# Altium schematic sheet FPGA_2.SchDoc: FMC DAC 1.5GS 4CH
size 420 x 297 mm; Author: G.Kasprowicz; CompanyName: WUT ISE; DrawnBy: G.Kasprowicz; Organization: WUT ISE; Address1: PW ISE; Address2: Nowowiejska 15/19 00-665 Warsaw; Address3: gkasprow@gmail.com; Revision: 1; SheetNumber: 22; SheetTotal: 25; ModifiedBy: -; CheckedDate: -; Title2: FMC; DivGrp: WUT ISE; Designer: G.Kasprowicz; ModifiedDate: -; ProjectName: Sensor Box
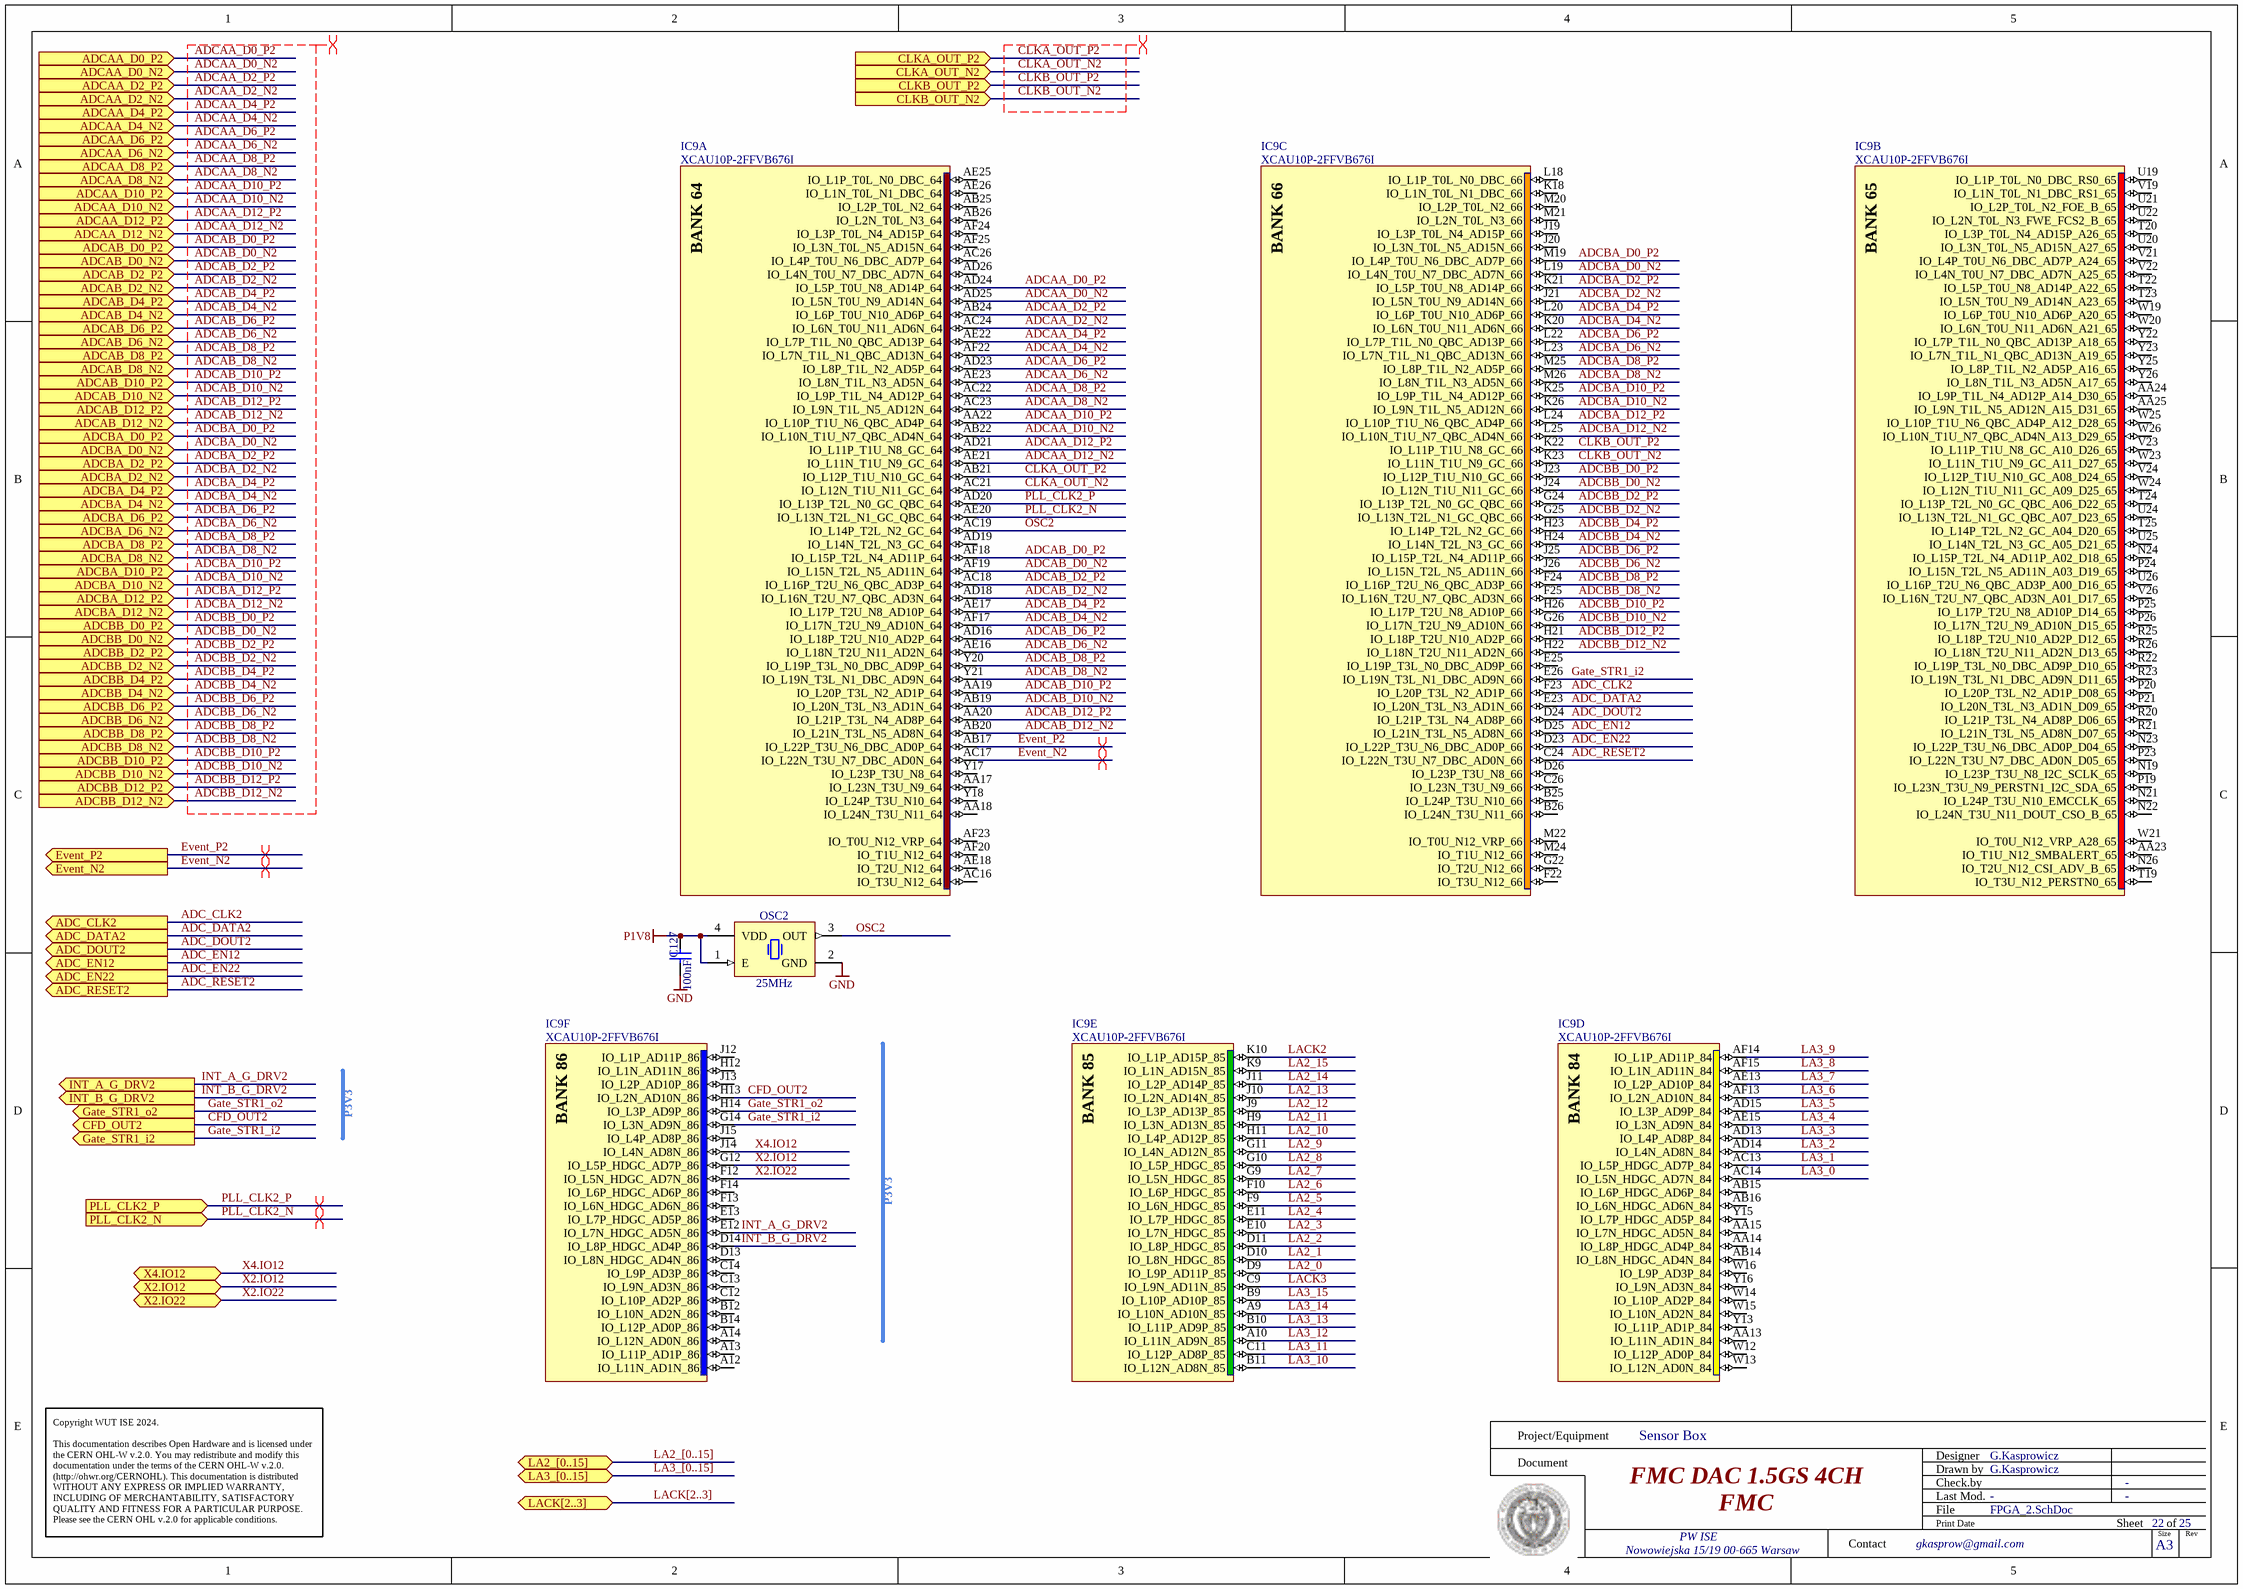
[diagram p0: FPGA_2.SchDoc]

## Parts
C127  100nF  [CAPC1005X55N]
IC9  XCAU10P-2FFVB676I  [BGA676C100P26X26_2700X2700X350]  (parts A,B,C,D,E,F of 13)
OSC2  25MHz  [OSC_ECS_ECS-3518]

## Ports
ADC_CLK2 (out), ADC_DATA2 (out), ADC_DOUT2 (out), ADC_EN12 (out), ADC_EN22 (out), ADC_RESET2 (out), ADCAA_D0_N2 (in), ADCAA_D0_P2 (in), ADCAA_D2_N2 (in), ADCAA_D2_P2 (in), ADCAA_D4_N2 (in), ADCAA_D4_P2 (in), ADCAA_D6_N2 (in), ADCAA_D6_P2 (in), ADCAA_D8_N2 (in), ADCAA_D8_P2 (in), ADCAA_D10_N2 (in), ADCAA_D10_P2 (in), ADCAA_D12_N2 (in), ADCAA_D12_P2 (in), ADCAB_D0_N2 (in), ADCAB_D0_P2 (in), ADCAB_D2_N2 (in), ADCAB_D2_P2 (in), ADCAB_D4_N2 (in), ADCAB_D4_P2 (in), ADCAB_D6_N2 (in), ADCAB_D6_P2 (in), ADCAB_D8_N2 (in), ADCAB_D8_P2 (in), ADCAB_D10_N2 (in), ADCAB_D10_P2 (in), ADCAB_D12_N2 (in), ADCAB_D12_P2 (in), ADCBA_D0_N2 (in), ADCBA_D0_P2 (in), ADCBA_D2_N2 (in), ADCBA_D2_P2 (in), ADCBA_D4_N2 (in), ADCBA_D4_P2 (in), ADCBA_D6_N2 (in), ADCBA_D6_P2 (in), ADCBA_D8_N2 (in), ADCBA_D8_P2 (in), ADCBA_D10_N2 (in), ADCBA_D10_P2 (in), ADCBA_D12_N2 (in), ADCBA_D12_P2 (in), ADCBB_D0_N2 (in), ADCBB_D0_P2 (in), ADCBB_D2_N2 (in), ADCBB_D2_P2 (in), ADCBB_D4_N2 (in), ADCBB_D4_P2 (in), ADCBB_D6_N2 (in), ADCBB_D6_P2 (in), ADCBB_D8_N2 (in), ADCBB_D8_P2 (in), ADCBB_D10_N2 (in), ADCBB_D10_P2 (in), ADCBB_D12_N2 (in), ADCBB_D12_P2 (in), CFD_OUT2 (out), CLKA_OUT_N2 (in), CLKA_OUT_P2 (in), CLKB_OUT_N2 (in), CLKB_OUT_P2 (in), Event_N2 (out), Event_P2 (out), Gate_STR1_i2 (out), Gate_STR1_o2 (out), INT_A_G_DRV2 (out), INT_B_G_DRV2 (out), LA2_[0..15] (bidir), LA3_[0..15] (bidir), LACK[2..3] (bidir), PLL_CLK2_N (in), PLL_CLK2_P (in), X2.IO12 (bidir), X2.IO22 (bidir), X4.IO12 (bidir)

## Nets
GND: C127.1 OSC2.2(GND)
P1V8: C127.2 OSC2.1(E) OSC2.4(VDD)
ADC_CLK2: IC9.F23(IO_L20P_T3L_N2_AD1P_66) ; port ADC_CLK2
ADC_DATA2: IC9.E23(IO_L20N_T3L_N3_AD1N_66) ; port ADC_DATA2
ADC_DOUT2: IC9.D24(IO_L21P_T3L_N4_AD8P_66) ; port ADC_DOUT2
ADC_EN12: IC9.D25(IO_L21N_T3L_N5_AD8N_66) ; port ADC_EN12
ADC_EN22: IC9.D23(IO_L22P_T3U_N6_DBC_AD0P_66) ; port ADC_EN22
ADC_RESET2: IC9.C24(IO_L22N_T3U_N7_DBC_AD0N_66) ; port ADC_RESET2
ADCAA_D0_N2: IC9.AD25(IO_L5N_T0U_N9_AD14N_64) ; port ADCAA_D0_N2
ADCAA_D0_P2: IC9.AD24(IO_L5P_T0U_N8_AD14P_64) ; port ADCAA_D0_P2
ADCAA_D2_N2: IC9.AC24(IO_L6N_T0U_N11_AD6N_64) ; port ADCAA_D2_N2
ADCAA_D2_P2: IC9.AB24(IO_L6P_T0U_N10_AD6P_64) ; port ADCAA_D2_P2
ADCAA_D4_N2: IC9.AF22(IO_L7N_T1L_N1_QBC_AD13N_64) ; port ADCAA_D4_N2
ADCAA_D4_P2: IC9.AE22(IO_L7P_T1L_N0_QBC_AD13P_64) ; port ADCAA_D4_P2
ADCAA_D6_N2: IC9.AE23(IO_L8N_T1L_N3_AD5N_64) ; port ADCAA_D6_N2
ADCAA_D6_P2: IC9.AD23(IO_L8P_T1L_N2_AD5P_64) ; port ADCAA_D6_P2
ADCAA_D8_N2: IC9.AC23(IO_L9N_T1L_N5_AD12N_64) ; port ADCAA_D8_N2
ADCAA_D8_P2: IC9.AC22(IO_L9P_T1L_N4_AD12P_64) ; port ADCAA_D8_P2
ADCAA_D10_N2: IC9.AB22(IO_L10N_T1U_N7_QBC_AD4N_64) ; port ADCAA_D10_N2
ADCAA_D10_P2: IC9.AA22(IO_L10P_T1U_N6_QBC_AD4P_64) ; port ADCAA_D10_P2
ADCAA_D12_N2: IC9.AE21(IO_L11N_T1U_N9_GC_64) ; port ADCAA_D12_N2
ADCAA_D12_P2: IC9.AD21(IO_L11P_T1U_N8_GC_64) ; port ADCAA_D12_P2
ADCAB_D0_N2: IC9.AF19(IO_L15N_T2L_N5_AD11N_64) ; port ADCAB_D0_N2
ADCAB_D0_P2: IC9.AF18(IO_L15P_T2L_N4_AD11P_64) ; port ADCAB_D0_P2
ADCAB_D2_N2: IC9.AD18(IO_L16N_T2U_N7_QBC_AD3N_64) ; port ADCAB_D2_N2
ADCAB_D2_P2: IC9.AC18(IO_L16P_T2U_N6_QBC_AD3P_64) ; port ADCAB_D2_P2
ADCAB_D4_N2: IC9.AF17(IO_L17N_T2U_N9_AD10N_64) ; port ADCAB_D4_N2
ADCAB_D4_P2: IC9.AE17(IO_L17P_T2U_N8_AD10P_64) ; port ADCAB_D4_P2
ADCAB_D6_N2: IC9.AE16(IO_L18N_T2U_N11_AD2N_64) ; port ADCAB_D6_N2
ADCAB_D6_P2: IC9.AD16(IO_L18P_T2U_N10_AD2P_64) ; port ADCAB_D6_P2
ADCAB_D8_N2: IC9.Y21(IO_L19N_T3L_N1_DBC_AD9N_64) ; port ADCAB_D8_N2
ADCAB_D8_P2: IC9.Y20(IO_L19P_T3L_N0_DBC_AD9P_64) ; port ADCAB_D8_P2
ADCAB_D10_N2: IC9.AB19(IO_L20N_T3L_N3_AD1N_64) ; port ADCAB_D10_N2
ADCAB_D10_P2: IC9.AA19(IO_L20P_T3L_N2_AD1P_64) ; port ADCAB_D10_P2
ADCAB_D12_N2: IC9.AB20(IO_L21N_T3L_N5_AD8N_64) ; port ADCAB_D12_N2
ADCAB_D12_P2: IC9.AA20(IO_L21P_T3L_N4_AD8P_64) ; port ADCAB_D12_P2
ADCBA_D0_N2: IC9.L19(IO_L4N_T0U_N7_DBC_AD7N_66) ; port ADCBA_D0_N2
ADCBA_D0_P2: IC9.M19(IO_L4P_T0U_N6_DBC_AD7P_66) ; port ADCBA_D0_P2
ADCBA_D2_N2: IC9.J21(IO_L5N_T0U_N9_AD14N_66) ; port ADCBA_D2_N2
ADCBA_D2_P2: IC9.K21(IO_L5P_T0U_N8_AD14P_66) ; port ADCBA_D2_P2
ADCBA_D4_N2: IC9.K20(IO_L6N_T0U_N11_AD6N_66) ; port ADCBA_D4_N2
ADCBA_D4_P2: IC9.L20(IO_L6P_T0U_N10_AD6P_66) ; port ADCBA_D4_P2
ADCBA_D6_N2: IC9.L23(IO_L7N_T1L_N1_QBC_AD13N_66) ; port ADCBA_D6_N2
ADCBA_D6_P2: IC9.L22(IO_L7P_T1L_N0_QBC_AD13P_66) ; port ADCBA_D6_P2
ADCBA_D8_N2: IC9.M26(IO_L8N_T1L_N3_AD5N_66) ; port ADCBA_D8_N2
ADCBA_D8_P2: IC9.M25(IO_L8P_T1L_N2_AD5P_66) ; port ADCBA_D8_P2
ADCBA_D10_N2: IC9.K26(IO_L9N_T1L_N5_AD12N_66) ; port ADCBA_D10_N2
ADCBA_D10_P2: IC9.K25(IO_L9P_T1L_N4_AD12P_66) ; port ADCBA_D10_P2
ADCBA_D12_N2: IC9.L25(IO_L10N_T1U_N7_QBC_AD4N_66) ; port ADCBA_D12_N2
ADCBA_D12_P2: IC9.L24(IO_L10P_T1U_N6_QBC_AD4P_66) ; port ADCBA_D12_P2
ADCBB_D0_N2: IC9.J24(IO_L12N_T1U_N11_GC_66) ; port ADCBB_D0_N2
ADCBB_D0_P2: IC9.J23(IO_L12P_T1U_N10_GC_66) ; port ADCBB_D0_P2
ADCBB_D2_N2: IC9.G25(IO_L13N_T2L_N1_GC_QBC_66) ; port ADCBB_D2_N2
ADCBB_D2_P2: IC9.G24(IO_L13P_T2L_N0_GC_QBC_66) ; port ADCBB_D2_P2
ADCBB_D4_N2: IC9.H24(IO_L14N_T2L_N3_GC_66) ; port ADCBB_D4_N2
ADCBB_D4_P2: IC9.H23(IO_L14P_T2L_N2_GC_66) ; port ADCBB_D4_P2
ADCBB_D6_N2: IC9.J26(IO_L15N_T2L_N5_AD11N_66) ; port ADCBB_D6_N2
ADCBB_D6_P2: IC9.J25(IO_L15P_T2L_N4_AD11P_66) ; port ADCBB_D6_P2
ADCBB_D8_N2: IC9.F25(IO_L16N_T2U_N7_QBC_AD3N_66) ; port ADCBB_D8_N2
ADCBB_D8_P2: IC9.F24(IO_L16P_T2U_N6_QBC_AD3P_66) ; port ADCBB_D8_P2
ADCBB_D10_N2: IC9.G26(IO_L17N_T2U_N9_AD10N_66) ; port ADCBB_D10_N2
ADCBB_D10_P2: IC9.H26(IO_L17P_T2U_N8_AD10P_66) ; port ADCBB_D10_P2
ADCBB_D12_N2: IC9.H22(IO_L18N_T2U_N11_AD2N_66) ; port ADCBB_D12_N2
ADCBB_D12_P2: IC9.H21(IO_L18P_T2U_N10_AD2P_66) ; port ADCBB_D12_P2
CFD_OUT2: IC9.H13(IO_L2N_AD10N_86) ; port CFD_OUT2
CLKA_OUT_N2: IC9.AC21(IO_L12N_T1U_N11_GC_64) ; port CLKA_OUT_N2
CLKA_OUT_P2: IC9.AB21(IO_L12P_T1U_N10_GC_64) ; port CLKA_OUT_P2
CLKB_OUT_N2: IC9.K23(IO_L11N_T1U_N9_GC_66) ; port CLKB_OUT_N2
CLKB_OUT_P2: IC9.K22(IO_L11P_T1U_N8_GC_66) ; port CLKB_OUT_P2
Event_N2: IC9.AC17(IO_L22N_T3U_N7_DBC_AD0N_64) ; port Event_N2
Event_P2: IC9.AB17(IO_L22P_T3U_N6_DBC_AD0P_64) ; port Event_P2
Gate_STR1_i2: IC9.E26(IO_L19N_T3L_N1_DBC_AD9N_66) IC9.G14(IO_L3N_AD9N_86) ; port Gate_STR1_i2
Gate_STR1_o2: IC9.H14(IO_L3P_AD9P_86) ; port Gate_STR1_o2
INT_A_G_DRV2: IC9.E12(IO_L7N_HDGC_AD5N_86) ; port INT_A_G_DRV2
INT_B_G_DRV2: IC9.D14(IO_L8P_HDGC_AD4P_86) ; port INT_B_G_DRV2
LA2_0: IC9.D9(IO_L9P_AD11P_85)
LA2_1: IC9.D10(IO_L8N_HDGC_85)
LA2_2: IC9.D11(IO_L8P_HDGC_85)
LA2_3: IC9.E10(IO_L7N_HDGC_85)
LA2_4: IC9.E11(IO_L7P_HDGC_85)
LA2_5: IC9.F9(IO_L6N_HDGC_85)
LA2_6: IC9.F10(IO_L6P_HDGC_85)
LA2_7: IC9.G9(IO_L5N_HDGC_85)
LA2_8: IC9.G10(IO_L5P_HDGC_85)
LA2_9: IC9.G11(IO_L4N_AD12N_85)
LA2_10: IC9.H11(IO_L4P_AD12P_85)
LA2_11: IC9.H9(IO_L3N_AD13N_85)
LA2_12: IC9.J9(IO_L3P_AD13P_85)
LA2_13: IC9.J10(IO_L2N_AD14N_85)
LA2_14: IC9.J11(IO_L2P_AD14P_85)
LA2_15: IC9.K9(IO_L1N_AD15N_85)
LA3_0: IC9.AC14(IO_L5N_HDGC_AD7N_84)
LA3_1: IC9.AC13(IO_L5P_HDGC_AD7P_84)
LA3_2: IC9.AD14(IO_L4N_AD8N_84)
LA3_3: IC9.AD13(IO_L4P_AD8P_84)
LA3_4: IC9.AE15(IO_L3N_AD9N_84)
LA3_5: IC9.AD15(IO_L3P_AD9P_84)
LA3_6: IC9.AF13(IO_L2N_AD10N_84)
LA3_7: IC9.AE13(IO_L2P_AD10P_84)
LA3_8: IC9.AF15(IO_L1N_AD11N_84)
LA3_9: IC9.AF14(IO_L1P_AD11P_84)
LA3_10: IC9.B11(IO_L12N_AD8N_85)
LA3_11: IC9.C11(IO_L12P_AD8P_85)
LA3_12: IC9.A10(IO_L11N_AD9N_85)
LA3_13: IC9.B10(IO_L11P_AD9P_85)
LA3_14: IC9.A9(IO_L10N_AD10N_85)
LA3_15: IC9.B9(IO_L10P_AD10P_85)
LACK2: IC9.K10(IO_L1P_AD15P_85)
LACK3: IC9.C9(IO_L9N_AD11N_85)
OSC2: IC9.AC19(IO_L14P_T2L_N2_GC_64) OSC2.3(OUT)
PLL_CLK2_N: IC9.AE20(IO_L13N_T2L_N1_GC_QBC_64) ; port PLL_CLK2_N
PLL_CLK2_P: IC9.AD20(IO_L13P_T2L_N0_GC_QBC_64) ; port PLL_CLK2_P
X2.IO12: IC9.G12(IO_L5P_HDGC_AD7P_86) ; port X2.IO12
X2.IO22: IC9.F12(IO_L5N_HDGC_AD7N_86) ; port X2.IO22
X4.IO12: IC9.J14(IO_L4N_AD8N_86) ; port X4.IO12

Not connected (* = marked no-connect by the designer): IC9 A12(IO_L11N_AD1N_86) A13(IO_L11P_AD1P_86) A14(IO_L12N_AD0N_86) AA13(IO_L11N_AD1N_84) AA14(IO_L8P_HDGC_AD4P_84) AA15(IO_L7N_HDGC_AD5N_84) AA17(IO_L23N_T3U_N9_64) AA18(IO_L24N_T3U_N11_64) AA23(IO_T1U_N12_SMBALERT_65) AA24(IO_L9P_T1L_N4_AD12P_A14_D30_65) AA25(IO_L9N_T1L_N5_AD12N_A15_D31_65) AB14(IO_L8N_HDGC_AD4N_84) AB15(IO_L6P_HDGC_AD6P_84) AB16(IO_L6N_HDGC_AD6N_84) AB25(IO_L2P_T0L_N2_64) AB26(IO_L2N_T0L_N3_64) AC16(IO_T3U_N12_64) AC26(IO_L4P_T0U_N6_DBC_AD7P_64) AD19(IO_L14N_T2L_N3_GC_64) AD26(IO_L4N_T0U_N7_DBC_AD7N_64) AE18(IO_T2U_N12_64) AE25(IO_L1P_T0L_N0_DBC_64) AE26(IO_L1N_T0L_N1_DBC_64) AF20(IO_T1U_N12_64) AF23(IO_T0U_N12_VRP_64) AF24(IO_L3P_T0L_N4_AD15P_64) AF25(IO_L3N_T0L_N5_AD15N_64) B12(IO_L10N_AD2N_86) B14(IO_L12P_AD0P_86) B25(IO_L24P_T3U_N10_66) B26(IO_L24N_T3U_N11_66) C12(IO_L10P_AD2P_86) C13(IO_L9N_AD3N_86) C14(IO_L9P_AD3P_86) C26(IO_L23N_T3U_N9_66) D13(IO_L8N_HDGC_AD4N_86) D26(IO_L23P_T3U_N8_66) E13(IO_L7P_HDGC_AD5P_86) E25(IO_L19P_T3L_N0_DBC_AD9P_66) F13(IO_L6N_HDGC_AD6N_86) F14(IO_L6P_HDGC_AD6P_86) F22(IO_T3U_N12_66) G22(IO_T2U_N12_66) H12(IO_L1N_AD11N_86) J12(IO_L1P_AD11P_86) J13(IO_L2P_AD10P_86) J15(IO_L4P_AD8P_86) J19(IO_L3P_T0L_N4_AD15P_66) J20(IO_L3N_T0L_N5_AD15N_66) K18(IO_L1N_T0L_N1_DBC_66) L18(IO_L1P_T0L_N0_DBC_66) M20(IO_L2P_T0L_N2_66) M21(IO_L2N_T0L_N3_66) M22(IO_T0U_N12_VRP_66) M24(IO_T1U_N12_66) N19(IO_L23P_T3U_N8_I2C_SCLK_65) N21(IO_L24P_T3U_N10_EMCCLK_65) N22(IO_L24N_T3U_N11_DOUT_CSO_B_65) N23(IO_L22P_T3U_N6_DBC_AD0P_D04_65) N24(IO_L15P_T2L_N4_AD11P_A02_D18_65) N26(IO_T2U_N12_CSI_ADV_B_65) P19(IO_L23N_T3U_N9_PERSTN1_I2C_SDA_65) P20(IO_L20P_T3L_N2_AD1P_D08_65) P21(IO_L20N_T3L_N3_AD1N_D09_65) P23(IO_L22N_T3U_N7_DBC_AD0N_D05_65) P24(IO_L15N_T2L_N5_AD11N_A03_D19_65) P25(IO_L17P_T2U_N8_AD10P_D14_65) P26(IO_L17N_T2U_N9_AD10N_D15_65) R20(IO_L21P_T3L_N4_AD8P_D06_65) R21(IO_L21N_T3L_N5_AD8N_D07_65) R22(IO_L19P_T3L_N0_DBC_AD9P_D10_65) R23(IO_L19N_T3L_N1_DBC_AD9N_D11_65) R25(IO_L18P_T2U_N10_AD2P_D12_65) R26(IO_L18N_T2U_N11_AD2N_D13_65) T19(IO_T3U_N12_PERSTN0_65) T20(IO_L3P_T0L_N4_AD15P_A26_65) T22(IO_L5P_T0U_N8_AD14P_A22_65) T23(IO_L5N_T0U_N9_AD14N_A23_65) T24(IO_L13P_T2L_N0_GC_QBC_A06_D22_65) T25(IO_L14P_T2L_N2_GC_A04_D20_65) U19(IO_L1P_T0L_N0_DBC_RS0_65) U20(IO_L3N_T0L_N5_AD15N_A27_65) U21(IO_L2P_T0L_N2_FOE_B_65) U22(IO_L2N_T0L_N3_FWE_FCS2_B_65) U24(IO_L13N_T2L_N1_GC_QBC_A07_D23_65) U25(IO_L14N_T2L_N3_GC_A05_D21_65) U26(IO_L16P_T2U_N6_QBC_AD3P_A00_D16_65) V19(IO_L1N_T0L_N1_DBC_RS1_65) V21(IO_L4P_T0U_N6_DBC_AD7P_A24_65) V22(IO_L4N_T0U_N7_DBC_AD7N_A25_65) V23(IO_L11P_T1U_N8_GC_A10_D26_65) V24(IO_L12P_T1U_N10_GC_A08_D24_65) V26(IO_L16N_T2U_N7_QBC_AD3N_A01_D17_65) W12(IO_L12P_AD0P_84) W13(IO_L12N_AD0N_84) W14(IO_L10P_AD2P_84) W15(IO_L10N_AD2N_84) W16(IO_L9P_AD3P_84) W19(IO_L6P_T0U_N10_AD6P_A20_65) W20(IO_L6N_T0U_N11_AD6N_A21_65) W21(IO_T0U_N12_VRP_A28_65) W23(IO_L11N_T1U_N9_GC_A11_D27_65) W24(IO_L12N_T1U_N11_GC_A09_D25_65) W25(IO_L10P_T1U_N6_QBC_AD4P_A12_D28_65) W26(IO_L10N_T1U_N7_QBC_AD4N_A13_D29_65) Y13(IO_L11P_AD1P_84) Y15(IO_L7P_HDGC_AD5P_84) Y16(IO_L9N_AD3N_84) Y17(IO_L23P_T3U_N8_64) Y18(IO_L24P_T3U_N10_64) Y22(IO_L7P_T1L_N0_QBC_AD13P_A18_65) Y23(IO_L7N_T1L_N1_QBC_AD13N_A19_65) Y25(IO_L8P_T1L_N2_AD5P_A16_65) Y26(IO_L8N_T1L_N3_AD5N_A17_65)

## Buses and harness runs
bus LA2_[0..15] = port LA2_[0..15]
bus LA3_[0..15] = port LA3_[0..15]
bus LACK[2..3] = port LACK[2..3]

## Layout directives
differential pair; differential pair class D100: ADCAA_D0_N2, ADCAA_D0_P2, ADCAA_D2_N2, ADCAA_D2_P2, ADCAA_D4_N2, ADCAA_D4_P2, ADCAA_D6_N2, ADCAA_D6_P2, ADCAA_D8_N2, ADCAA_D8_P2, ADCAA_D10_N2, ADCAA_D10_P2, ADCAA_D12_N2, ADCAA_D12_P2, ADCAB_D0_N2, ADCAB_D0_P2, ADCAB_D2_N2, ADCAB_D2_P2, ADCAB_D4_N2, ADCAB_D4_P2, ADCAB_D6_N2, ADCAB_D6_P2, ADCAB_D8_N2, ADCAB_D8_P2, ADCAB_D10_N2, ADCAB_D10_P2, ADCAB_D12_N2, ADCAB_D12_P2, ADCBA_D0_N2, ADCBA_D0_P2, ADCBA_D2_N2, ADCBA_D2_P2, ADCBA_D4_N2, ADCBA_D4_P2, ADCBA_D6_N2, ADCBA_D6_P2, ADCBA_D8_N2, ADCBA_D8_P2, ADCBA_D10_N2, ADCBA_D10_P2, ADCBA_D12_N2, ADCBA_D12_P2, ADCBB_D0_N2, ADCBB_D0_P2, ADCBB_D2_N2, ADCBB_D2_P2, ADCBB_D4_N2, ADCBB_D4_P2, ADCBB_D6_N2, ADCBB_D6_P2, ADCBB_D8_N2, ADCBB_D8_P2, ADCBB_D10_N2, ADCBB_D10_P2, ADCBB_D12_N2, ADCBB_D12_P2, CLKA_OUT_N2, CLKA_OUT_P2, CLKB_OUT_N2, CLKB_OUT_P2, Event_N2, Event_P2, PLL_CLK2_N, PLL_CLK2_P

## Notes on the sheet
- P3V3
- Project/Equipment
- Document
- Designer
- Drawn by
- Check.by
- Copyright WUT ISE 2024.
  This documentation describes Open Hardware and is licensed under the CERN OHL-W v.2.0. You may redistribute and modify this documentation under the terms of the CERN OHL-W v.2.0. (http://ohwr.org/CERNOHL). This documentation is distributed WITHOUT ANY EXPRESS OR IMPLIED WARRANTY, INCLUDING OF MERCHANTABILITY, SATISFACTORY QUALITY AND FITNESS FOR A PARTICULAR PURPOSE. Please see the CERN OHL v.2.0 for applicable conditions.
- Contact
- File
- Last Mod.
- Print Date
- Sheet
- Size
- A3
- of
- Rev
- (in symbol XCAU10P-2FFVB676I, part A) BANK 64
- (in symbol XCAU10P-2FFVB676I, part B) BANK 65
- (in symbol XCAU10P-2FFVB676I, part C) BANK 66
- (in symbol XCAU10P-2FFVB676I, part D) BANK 84
- (in symbol XCAU10P-2FFVB676I, part E) BANK 85
- (in symbol XCAU10P-2FFVB676I, part F) BANK 86

## Library data of the parts
C127 = CC0402_100NF_16V_10%_X5R: Non-polarised capacitor; Part Description: SMD Multilayer Chip Ceramic Capacitor; Manufacturer: GENERIC; Manufacturer1 Part Number: GRM155R61C104KA88D; Voltage: 16V; TC: X5R; Tolerance: ±10%; Part Number: CC0402_100NF_16V_10%_X5R; Component Kind: Standard; Component Type: Standard; Pin Count: 2; Value: 100nF; Status: None; Manufacturer Part Number: CC0402_100NF_16V_10%_X5R; Case: 0402; Mounted: Yes; Socket: No; SMD: Yes; Sense: No; Manufacturer1 Example: MURATA; Manufacturer1 ComponentHeight: 0.55mm; HelpURL: \\cern.ch\dfs\Applications\Altium\Datasheets\CC0402_X5R_MURATA_GRM.pdf; Author: CERN DEM JLC; CreateDate: 10.12.2013; LatestRevisionDate: 10.12.2013
IC9 = XCAU10P-2FFVB676I: Artix UltraScale + Field Programmable Gate Array (FPGA), 676-Pin BGA, Industrial Grade; Manufacturer: AMD; PressFit: No; Bonding: No; Part Number: XCAU10P-2FFVB676I; Component Kind: Standard; Component Type: Standard; Device: XCAU10P-2FFVB676I; PackageDescription: BGA, 1.00mm Pitch, Square; 672 Pin, 26 Columns X 26 Rows, Body 27.00mm X 27.00mm X 3.50mm H, IPC Medium Density; Part Description: Artix UltraScale + Field Programmable Gate Array (FPGA), 676-Pin BGA, Industrial Grade; Manufacturer Part Number: XCAU10P-2FFVB676I; Pin Count: 676; Case: BGA676; Mounted: Yes; Socket: No; SMD: Yes; Sense: No; ComponentHeight: 3.50mm; HelpURL: \\cern.ch\dfs\Applications\Altium\Datasheets\XCAU10P-2FFVB676I.pdf; ComponentLink1URL: \\cern.ch\dfs\Applications\Altium\Datasheets\XCAU10P-2FFVB676I_Package.pdf; ComponentLink1Description: Package Drawing; ComponentLink2URL: \\cern.ch\dfs\Applications\Altium\Datasheets\XCAU10P-2FFVB676I_Pinout.pdf; ComponentLink2Description: Pinout; Author: CERN DEM HF; CreateDate: 10.02.2025; LatestRevisionDate: 10.02.2025
OSC2 = OSC_25MHZ_ECS_ECS-3518-250-B: Oscillator 4 pins 1=E/D 2=GND 3=OUT 4=VDD; Part Description: 1.8V, ±50ppm, 15pF, -0 to 70°C, Surface Mount Clock Oscillator (ECS-3518/3525 Series); Manufacturer: ECS; PressFit: No; Bonding: No; Part Number: OSC_25MHZ_ECS_ECS-3518-250-B; Component Kind: Standard; Component Type: Standard; PackageDescription: Oscillator, Corner Concave, 2.50mm Pitch, 4 Pin, 3.20mm L X 5.00mm W X 1.30mm H, ECS-3518 Series; Value: 25MHz; Manufacturer Part Number: ECS-3518-250-B; Pin Count: 4; Mounted: Yes; Socket: No; SMD: Yes; Sense: No; ComponentHeight: 1.3mm; HelpURL: \\cern.ch\dfs\Applications\Altium\Datasheets\OSC_ECS_ECS-3518.pdf; Author: CERN DEM JLC; CreateDate: 14.08.2017; LatestRevisionDate: 14.08.2017